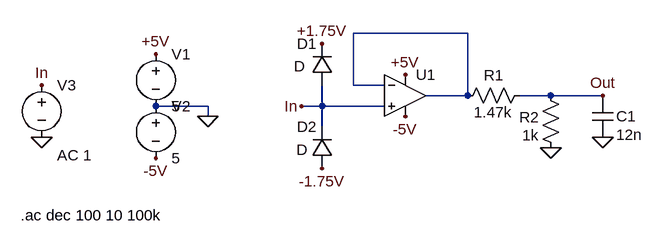
[diagram p0: schematic pre_amplifier.asc]
pre_amplifier.asc, the LTspice schematic file:
Version 4
SHEET 1 880 680
WIRE 256 64 80 64
WIRE 80 144 80 64
WIRE 128 144 80 144
WIRE 256 160 256 64
WIRE 256 160 192 160
WIRE 384 160 336 160
WIRE 464 160 384 160
WIRE -144 176 -224 176
WIRE 32 176 32 144
WIRE 32 176 0 176
WIRE 128 176 32 176
WIRE -144 192 -144 176
WIRE 32 208 32 176
FLAG -224 96 +5V
FLAG -224 256 -5V
FLAG 160 192 -5V
FLAG 160 128 +5V
FLAG 384 240 0
FLAG 464 224 0
FLAG -144 192 0
FLAG 0 176 In
FLAG 464 160 Out
FLAG -400 224 0
FLAG -400 144 In
FLAG 32 80 +1.75V
FLAG 32 272 -1.75V
SYMBOL OpAmps\\UniversalOpAmp 160 160 R0
SYMATTR InstName U1
SYMBOL voltage -224 80 R0
WINDOW 123 0 0 Left 0
WINDOW 39 0 0 Left 0
SYMATTR InstName V1
SYMATTR Value 5
SYMBOL voltage -224 160 R0
WINDOW 123 0 0 Left 0
WINDOW 39 0 0 Left 0
SYMATTR InstName V2
SYMATTR Value 5
SYMBOL res 352 144 R90
WINDOW 0 0 56 VBottom 2
WINDOW 3 57 57 VBottom 2
SYMATTR InstName R1
SYMATTR Value 1.47k
SYMBOL res 400 256 R180
WINDOW 0 34 63 Left 2
WINDOW 3 34 35 Left 2
SYMATTR InstName R2
SYMATTR Value 1k
SYMBOL cap 448 160 R0
WINDOW 0 37 32 Left 2
WINDOW 3 37 60 Left 2
SYMATTR InstName C1
SYMATTR Value 12n
SYMBOL voltage -400 128 R0
WINDOW 123 24 124 Left 2
WINDOW 39 0 0 Left 0
SYMATTR InstName V3
SYMATTR Value ""
SYMATTR Value2 AC 1
SYMBOL diode 48 144 R180
WINDOW 0 24 64 Left 2
WINDOW 3 42 29 Left 2
SYMATTR InstName D1
SYMBOL diode 48 272 R180
WINDOW 0 24 64 Left 2
WINDOW 3 38 29 Left 2
SYMATTR InstName D2
TEXT -432 344 Left 2 !.ac dec 100 10 100k

The netlist it stands for:
* pre_amplifier.asc
XU1 In N001 +5V -5V N001 level1 Avol=1Meg GBW=10Meg Vos=0 En=0 Enk=0 In=0 Ink=0 Rin=500Meg  ; pins In+ In- V+ V- OUT
V1 +5V 0 5
V2 0 -5V 5
R1 Out N001 1.47k
R2 0 Out 1k
C1 Out 0 12n
V3 In 0 AC 1
D1 In +1.75V D
D2 -1.75V In D
.model D D
.lib standard.dio
.ac dec 100 10 100k
.lib UniversalOpAmp1.lib
.backanno
.end